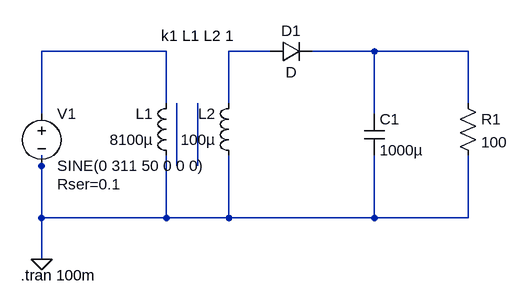
[diagram p0: schematic LTSpice_Exercise1_Transformer.asc]
LTSpice_Exercise1_Transformer.asc, the LTspice schematic file:
Version 4.1
SHEET 1 880 680
WIRE 192 80 0 80
WIRE 352 80 288 80
WIRE 512 80 416 80
WIRE 656 80 512 80
WIRE 192 160 192 80
WIRE 288 160 288 80
WIRE 656 160 656 80
WIRE 0 176 0 80
WIRE 512 176 512 80
WIRE 0 256 0 240
WIRE 208 256 208 160
WIRE 240 256 240 160
WIRE 0 336 0 256
WIRE 192 336 192 240
WIRE 192 336 0 336
WIRE 288 336 288 240
WIRE 288 336 192 336
WIRE 512 336 512 240
WIRE 512 336 288 336
WIRE 656 336 656 240
WIRE 656 336 512 336
WIRE 0 400 0 336
FLAG 0 400 0
SYMBOL voltage 0 160 R0
WINDOW 123 0 0 Left 0
WINDOW 39 24 124 Left 2
SYMATTR InstName V1
SYMATTR Value SINE(0 311 50 0 0 0)
SYMATTR SpiceLine Rser=0.1
SYMBOL diode 352 96 R270
WINDOW 0 32 32 VTop 2
WINDOW 3 0 32 VBottom 2
SYMATTR InstName D1
SYMBOL cap 496 176 R0
SYMATTR InstName C1
SYMATTR Value 1000µ
SYMBOL res 640 144 R0
SYMATTR InstName R1
SYMATTR Value 100
SYMBOL ind 208 256 R180
WINDOW 0 36 80 Left 2
WINDOW 3 36 40 Left 2
SYMATTR InstName L1
SYMATTR Value 8100µ
SYMATTR Type ind
SYMATTR SpiceLine Rser=1m
SYMBOL ind 304 256 R180
WINDOW 0 36 80 Left 2
WINDOW 3 36 40 Left 2
SYMATTR InstName L2
SYMATTR Value 100µ
SYMATTR Type ind
SYMATTR SpiceLine Rser=1m
TEXT 184 56 Left 2 !k1 L1 L2 1
TEXT -32 424 Left 2 !.tran 100m

The netlist it stands for:
* LTSpice_Exercise1_Transformer.asc
V1 N001 0 SINE(0 311 50 0 0 0) Rser=0.1
D1 N002 N003 D
C1 N003 0 1000µ
R1 N003 0 100
L1 0 N001 8100µ Rser=1m
L2 0 N002 100µ Rser=1m
.model D D
.lib standard.dio
k1 L1 L2 1
.tran 100m
.backanno
.end